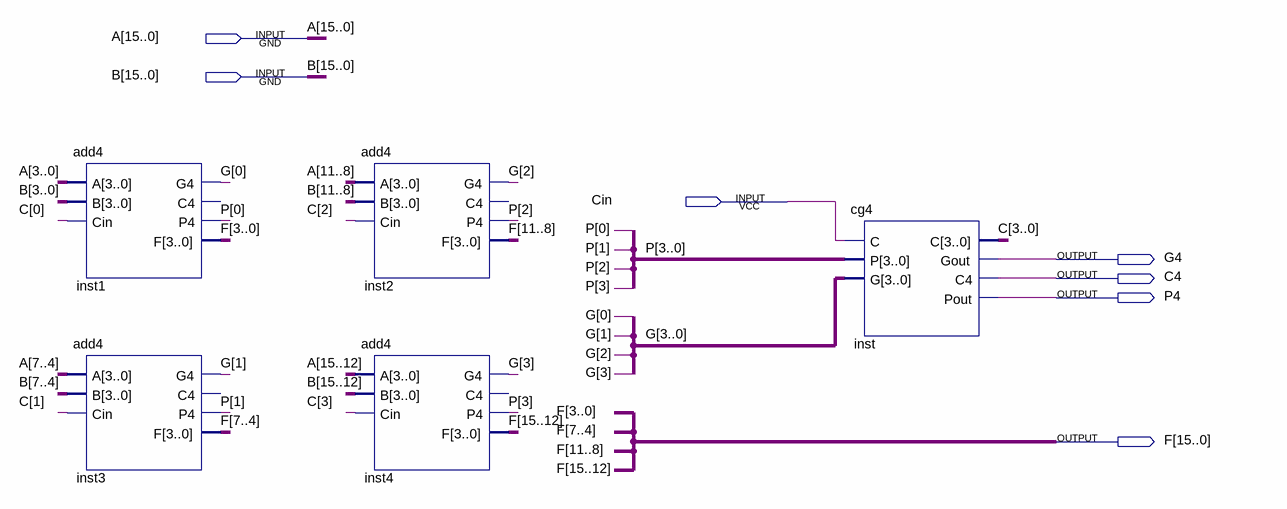
[diagram p0: schematic sheet]
// Quartus schematic add16.bdf as structural Verilog: 5 symbols, 7 pins
module add16 (
  input  [15:0] A,
  input  [15:0] B,
  input  Cin,
  output G4,
  output C4,
  output P4,
  output [15:0] F
);

  wire [3:0] C, G, P;

  add4 inst1 (.A(A[3:0]), .B(B[3:0]), .Cin(C[0]), .G4(G[0]), .P4(P[0]), .F(F[3:0]));  // open: C4
  add4 inst3 (.A(A[7:4]), .B(B[7:4]), .Cin(C[1]), .G4(G[1]), .P4(P[1]), .F(F[7:4]));  // open: C4
  add4 inst2 (.A(A[11:8]), .B(B[11:8]), .Cin(C[2]), .G4(G[2]), .P4(P[2]), .F(F[11:8]));  // open: C4
  add4 inst4 (.A(A[15:12]), .B(B[15:12]), .Cin(C[3]), .G4(G[3]), .P4(P[3]), .F(F[15:12]));  // open: C4
  cg4 inst (.C({C[3:1], Cin, C[0]}), .P(P), .G(G), .Gout(G4), .C4(C4), .Pout(P4));
endmodule
